# Altium schematic sheet Micros.SchDoc
size A4; SheetNumber: 1; SheetTotal: 1
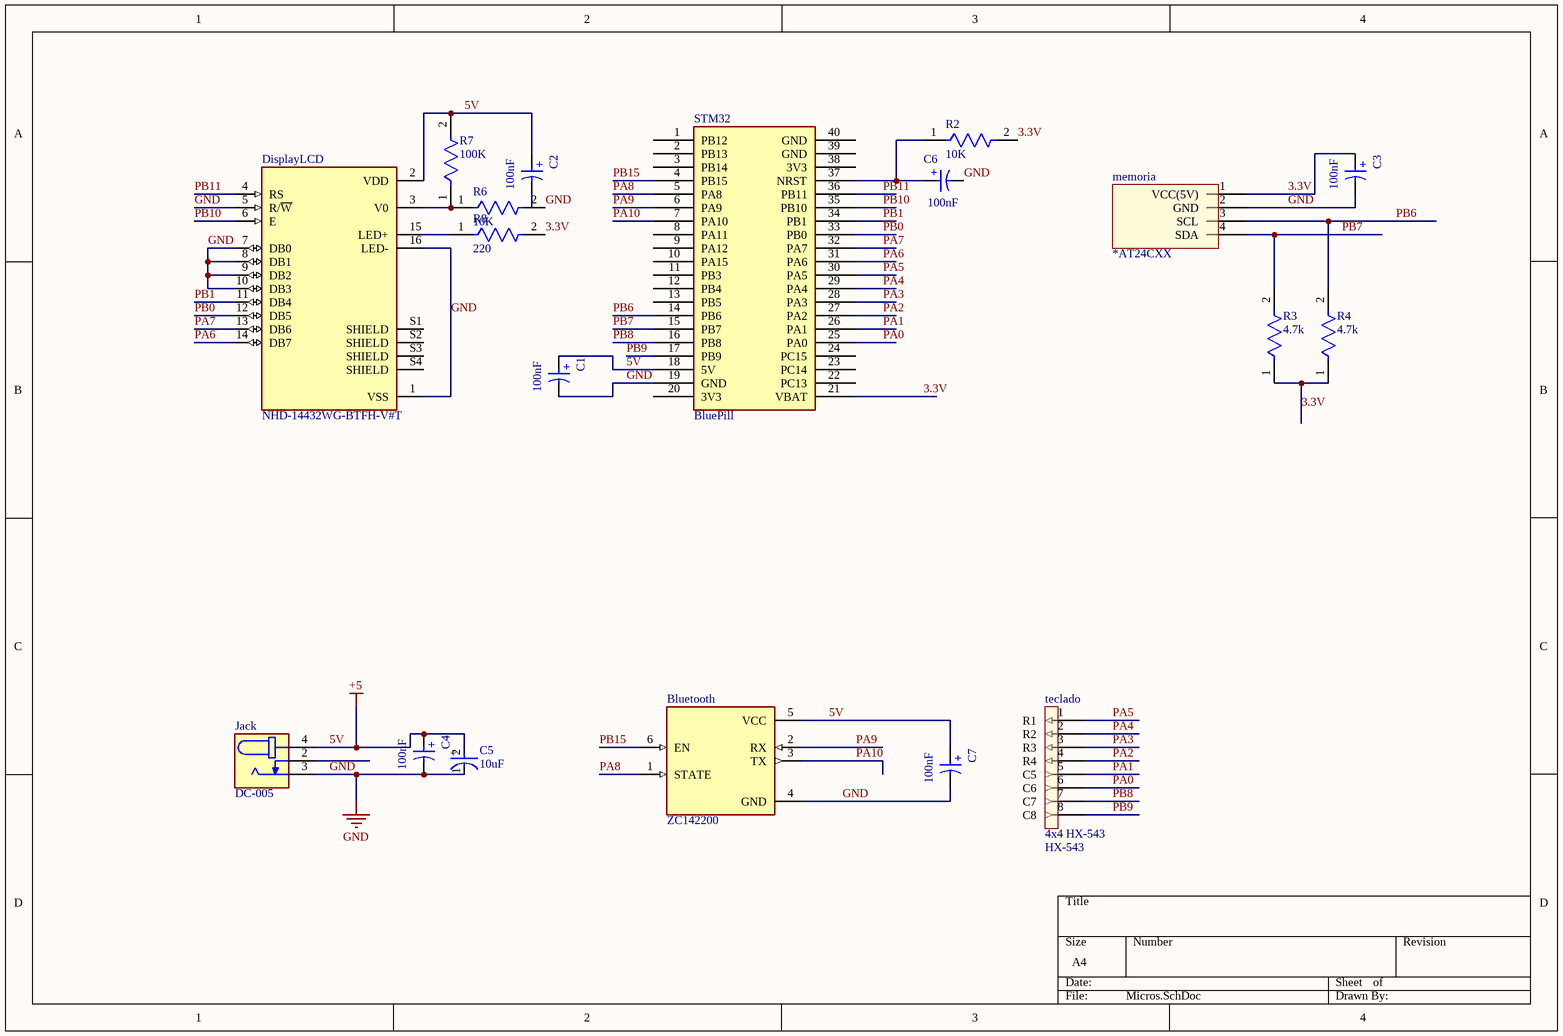
[diagram p0: Micros.SchDoc]

## Parts
Bluetooth  ZC142200  [MODULE_ZC142200]
C1  100nF  [WCAP-ATG8_D5H11]
C2  100nF  [WCAP-ATG8_D5H11]
C3  100nF  [WCAP-ATG8_D5H11]
C4  100nF  [WCAP-ATG8_D5H11]
C5  10uF  [FP-RAD-TH-D_5_0_5-L_11_1-MFG]
C6  100nF  [WCAP-ATG8_D5H11]
C7  100nF  [WCAP-ATG8_D5H11]
DisplayLCD  NHD-14432WG-BTFH-V#T  [LCD_NHD-14432WG-BTFH-V#T]
Jack  DC-005  [NINIGI_DC-005]
memoria  Parameter 1: *AT24CXX  [memória]  (hidden comment: memória)
R2  10K  [FP-MF0207-MFG]
R3  4.7k  [FP-RCMM02-MFG]
R4  4.7k  [FP-RCMM02-MFG]
R6  10K  [FP-MF0207-MFG]
R7  100K  [FP-PR02000201003JA100-MFG]
R8  220  [FP-MBA0204-MFG]
STM32  BluePill  [Stm32 BluePill]
teclado  4x4 HX-543  value HX-543  [Teclado]

## Nets
5V: Bluetooth.5(VCC) C1.1(P) C2.1(P) C4.1(P) C5.2(A) C7.1(P) DisplayLCD.2(VDD) Jack.4 R7.2 STM32.18(5V)  [also labelled +5]
GND: Bluetooth.4(GND) C1.2(N) C3.2(N) C4.2(N) C5.1(C) C6.2(N) C7.2(N) DisplayLCD.1(VSS) DisplayLCD.5(R/~{W}) DisplayLCD.7(DB0) DisplayLCD.8(DB1) DisplayLCD.9(DB2) DisplayLCD.10(DB3) DisplayLCD.16(LED-) Jack.3 memoria.2(GND) R6.2 STM32.19(GND)
3.3V: C3.1(P) memoria.1(VCC(5V)) R2.2 R3.1 R4.1 R8.2 STM32.21(VBAT)
PA0: STM32.25(PA0) teclado.6(C6)
PA1: STM32.26(PA1) teclado.5(C5)
PA2: STM32.27(PA2) teclado.4(R4)
PA3: STM32.28(PA3) teclado.3(R3)
PA4: STM32.29(PA4) teclado.2(R2)
PA5: STM32.30(PA5) teclado.1(R1)
PA6: DisplayLCD.14(DB7) STM32.31(PA6)
PA7: DisplayLCD.13(DB6) STM32.32(PA7)
PA8: Bluetooth.1(STATE) STM32.5(PA8)
PA9: Bluetooth.2(RX) STM32.6(PA9)
PA10: Bluetooth.3(TX) STM32.7(PA10)
PB0: DisplayLCD.12(DB5) STM32.33(PB0)
PB1: DisplayLCD.11(DB4) STM32.34(PB1)
PB6: memoria.3(SCL) R4.2 STM32.14(PB6)
PB7: memoria.4(SDA) R3.2 STM32.15(PB7)
PB8: STM32.16(PB8) teclado.7(C7)
PB9: STM32.17(PB9) teclado.8(C8)
PB10: DisplayLCD.6(E) STM32.35(PB10)
PB11: DisplayLCD.4(RS) STM32.36(PB11)
PB15: Bluetooth.6(EN) STM32.4(PB15)
NetC6_1: C6.1(P) R2.1 STM32.37(NRST)
NetDisplayLCD_3: DisplayLCD.3(V0) R6.1 R7.1
NetDisplayLCD_15: DisplayLCD.15(LED+) R8.1

Not connected (* = marked no-connect by the designer): C2 2(N); DisplayLCD S1(SHIELD) S2(SHIELD) S3(SHIELD) S4(SHIELD); Jack 2(4); STM32 1(PB12) 2(PB13) 3(PB14) 8(PA11) 9(PA12) 10(PA15) 11(PB3) 12(PB4) 13(PB5) 20(3V3) 22(PC13) 23(PC14) 24(PC15) 38(3V3) 39(GND) 40(GND)

## Notes on the sheet
- (in symbol CMP-03913-53914132-2) +
- (in symbol CMP-05427-000260-1) +

## Library data of the parts
Bluetooth = CMP-013-000000-1: 1pc HC-05 6 Pin Wireless Bluetooth RF Transceiver Module Serial For Arduino; MF: YKS; Pin Count: 6; SnapEDA_Link: https://www.snapeda.com/parts/ZC142200/YKS/view-part/?ref=snap; Check_prices: https://www.snapeda.com/parts/ZC142200/YKS/view-part/?ref=eda; Source: ZC142200.SchLib; Value: *; Package: None; Design Item ID: ZC142200; MP: ZC142200; Component Type: Standard
C1-C4 C6 C7 = CMP-03913-53914132-2: Alum. Electrolytic Cap 100NF 63V 5MM Radial WCAP-ATG8; Lifetime 2000H +85°C; Leakage Current: 3µA; Pitch: 2mm; Ripple Current: 4mA; Tolerance: 20%; Life (Hours): 2000hours; Polarity: Polar; Lead Pitch: 2.0066mm; Diameter: 5mm; Voltage Rating (DC): 63V; Mount: Through Hole; Case/Package: Radial; Packaging: Tape & Box (TB); Capacitance: 100nF; Voltage Rating: 63V; Max Operating Temperature: 85°C; Height - Seated (Max): 12.4968mm; Height: 11mm; Length: 11mm; Min Operating Temperature: -40°C; REACH SVHC: Unknown; RoHS: Compliant
C5 = CMP-05427-000260-1: Aluminum Electrolytic Capacitors (Radial Lead Type) AEC-Q200 Qualified 10uF ±20% 50V; Lead Diameter: 0.5mm; Polarity: Polar; Leakage Current: 3uA; Life (Hours): 1000Hour; Ripple Current: 39mA; Lead/Base Style: Straight; Max Operating Temperature: 105°C; Voltage Rating (DC): 50V; Diameter: 5mm; RoHS Compliant: Yes; Capacitance: 10uF; Packaging: Ammo Pack; Series: NHG; Construction: RADIAL; Length: 11mm; Tolerance: 20%; Height - Seated (Max): 0.472inch; Contact Plating: Tin; Height: 11mm; Min Operating Temperature: -55°C; Radiation Hardening: No; Package Quantity: 2000; Mount: Through Hole; Voltage Rating: 50V; Lead Pitch: 2.5mm; Termination: Radial; Lead Free: Lead Free; Case/Package: Radial
DisplayLCD = CMP-007-00036-1: - Graphic LCD Display Module Transflective Black (White - Inverted) FSTN - Film Super-Twisted Nematic Parallel, 8-Bit - 144 x 32; MF: Newhaven Display; Price: None; Source: NHD-14432WG-BTFH-V#T.SchLib; SnapEDA_Link: https://www.snapeda.com/parts/NHD-14432WG-BTFH-V%23T/Newhaven+Display+Intl/view-part/?ref=snap; MP: NHD-14432WG-BTFH-V#T; Design Item ID: NHD-14432WG-BTFH-V#T; Value: *; Check_prices: https://www.snapeda.com/parts/NHD-14432WG-BTFH-V%23T/Newhaven+Display+Intl/view-part/?ref=eda; Component Type: Standard; Case/Package: None; Pins: 20; Availability: In Stock; Purchase-URL: https://pricing.snapeda.com/search/part/NHD-14432WG-BTFH-V#T/?ref=eda
Jack = CMP-002-00071-1: DC Jack; Price: None; Availability: Unavailable; Component Type: Standard; Design Item ID: DC-005; Value: *; MP: DC-005; Case/Package: None; Source: DC-005.SchLib; Pins: 3
memoria = memoria: AT24CXX
R2 R6 = CMP-03413-000006-1: RES 10K OHM 1% 0.6W AXIAL; Temperature Coefficient: 50ppm/°C; Resistance: 10kR; Mount: Through Hole; Radiation Hardening: No; Tolerance: 1%; Construction: Cylindrical; Contact Plating: Tin; Case/Package: Conformal; Resistor Type: Metal Film; Min Operating Temperature: -55°C; Military Standard: Not; Lead Free: Lead Free; Diameter: 2.4mm; Termination: Axial; Max Operating Temperature: 155°C; RoHS Compliant: Yes; Packaging: Ammo Pack; Length: 6.3mm
R3 R4 = CMP-02408-000034-1: RES 4.7K OHM 2% 1/2W AXIAL; Temperature Coefficient: 100ppm/°C; Resistance: 4.7kR; RoHS Compliant: Yes; Contact Plating: Tin; Tolerance: 2%; Diameter: 2.5mm; Case/Package: Molded; Length: 6.5mm; Mount: Through Hole; Resistor Type: Metal Film
R7 = CMP-00030-42817933-1: PR02000201003JA100 Fixed Resistor, Metal Film, 2W, 100000ohm, 500V, 5% +/-Tol, 250ppm/Cel, Through Hole Mount; Resistance: 100kΩ; Temperature Coefficient: 250ppm/°C; Case/Package: Conformal; Lead Free: Lead Free; Composition: Metal Film; Schedule B: 8533210090, 8533210090; Tolerance: 5%; RoHS: Compliant; Min Operating Temperature: -55°C; NexarPartId: 42817933; Diameter: 3.9mm; Max Operating Temperature: 155°C; Voltage Rating: 500V; Length: 12mm; Width: 3.9mm; Contact Plating: Tin; REACH SVHC: No SVHC; Operating Supply Voltage: 500V; Termination: Axial; Power Rating: 2W; Military Standard: Not; Radiation Hardening: No; Mount: Through Hole; Voltage Rating (DC): 500V
R8 = CMP-02408-000005-1: RES 220 OHM 0.4W 1% AXIAL; Manufacturer Part Number: MBA02040C2200FC100; Manufacturer: Vishay BC Components; Automotive Grade: Grade 1; Value: 220Ω; Voltage Rating: 200V; Temperature Coefficient: 50ppm/°C; Power Rating: 0.25W; Digikey Description: RES 220 OHM 0.4W 1% AXIAL; Height: 1.6mm; Automotive: Yes; Lead Free: Yes; Mouser Description: Thin Film Resistors - Through Hole .4watt 220ohms 1% 1/8watt body size; Temperature Range Low: -55°C; ComponentLink2Description: Datasheet; Temperature: -55°C to +125°C; Device Class L3: Through-Hole Resistors; Ipc Land Pattern Name: RESAD500W65L360D160; Octopart: https://octopart.com/mba02040c2200fc100-vishay-43743094; Series: MBA/SMA 0204; RoHS: TRUE; Tolerance: 1%; Package: MBA0204; Device Class L1: Passive Components; ComponentLink2URL: http://www.vishay.com/docs/28766/mbxsma.pdf; Category: Res; Composition: Metal Film; Device Class L2: Resistors; Temperature Range High: +125°C; Resistance: 220Ω
STM32 = CMP-007-000000-1: Designed By @Alixahedi; Design Item ID: BluePill; Component Type: Standard; Pin Count: 40; Source: Schlib1.SchLib
teclado = teclado: teclado 4x4 HX-543; pin to pad: 1>R1 2>R2 3>R3 4>R4 5>C1 6>C2 7>C3 8>C4